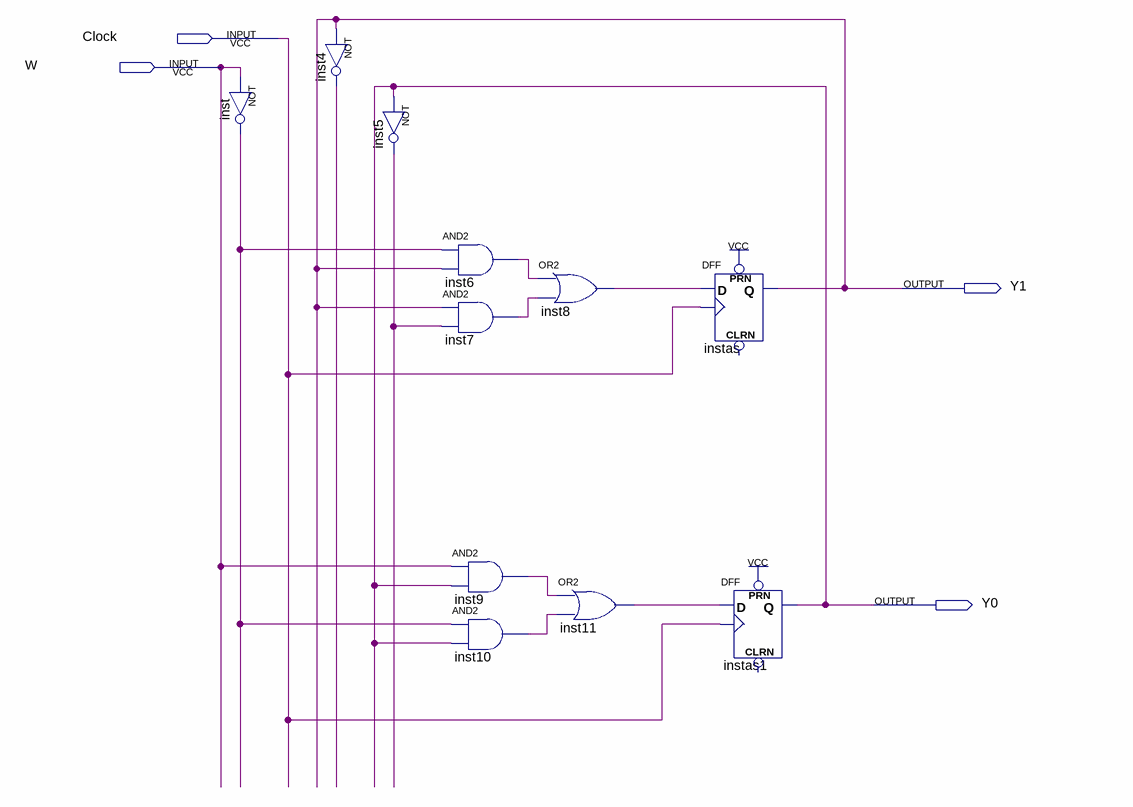
[diagram p0: schematic sheet]
// Quartus schematic 2bitcounter.bdf as structural Verilog: 11 symbols, 4 pins
module \2bitcounter  (
  input  Clock,
  input  W,
  output Y1,
  output Y0
);

  wire inst4_out, inst5_out, inst6_out, inst7_out, inst8_out, inst9_out, inst10_out, inst11_out, inst_out;

  not inst (inst_out, W);
  not inst4 (inst4_out, Y1);
  not inst5 (inst5_out, Y0);
  and inst6 (inst6_out, inst_out, Y1);
  and inst7 (inst7_out, Y1, inst5_out);
  and inst9 (inst9_out, W, Y0);
  and inst10 (inst10_out, inst_out, Y0);
  or inst8 (inst8_out, inst6_out, inst7_out);
  or inst11 (inst11_out, inst9_out, inst10_out);
  DFF instas (.CLK(Clock), .D(inst8_out), .PRN(1'b1), .Q(Y1));  // open: CLRN
  DFF instas1 (.CLK(Clock), .D(inst11_out), .PRN(1'b1), .Q(Y0));  // open: CLRN
endmodule
